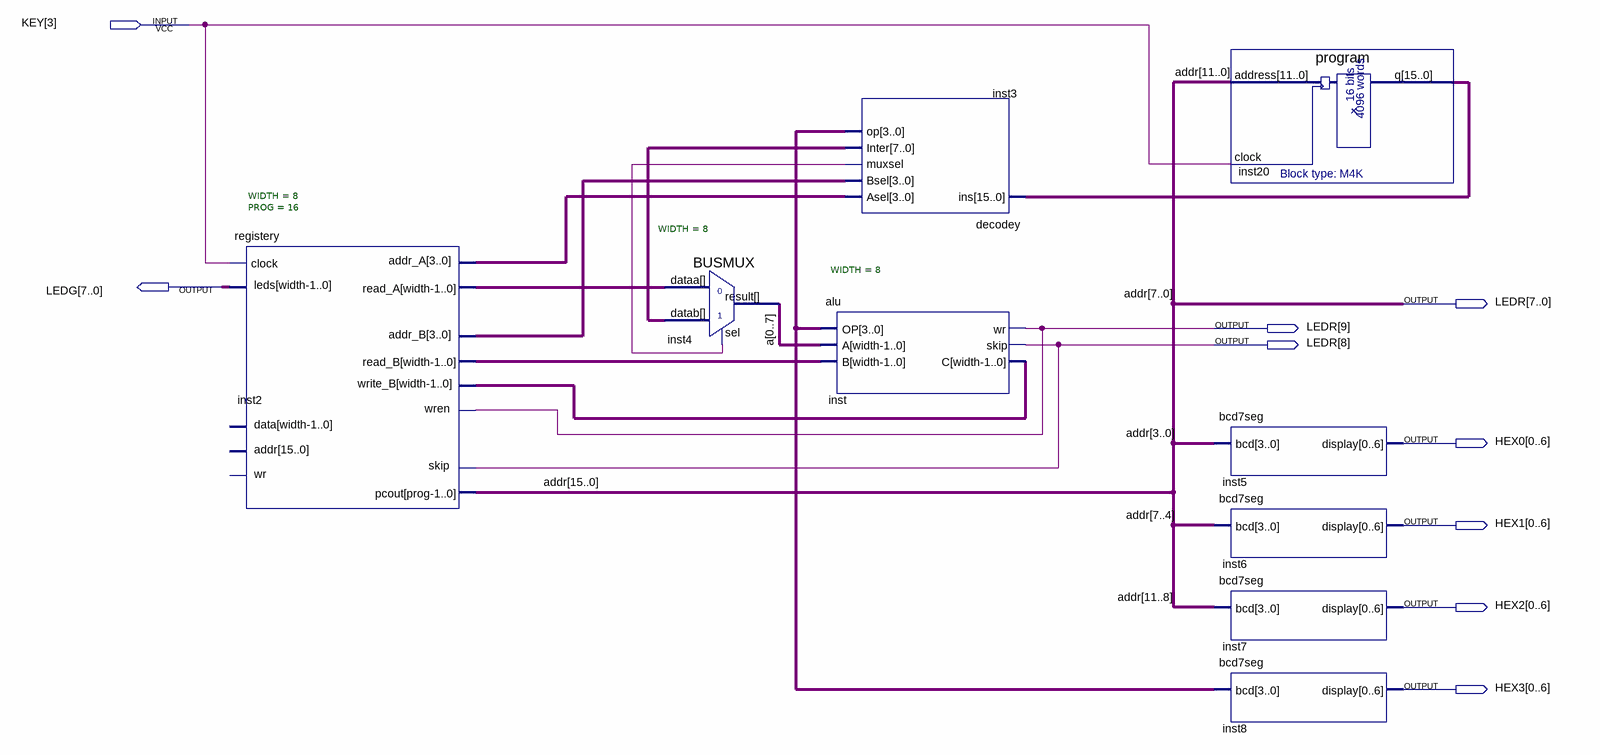
[diagram p0: schematic sheet]
// Quartus schematic SXT8C204.bdf as structural Verilog: 9 symbols, 9 pins
module SXT8C204 (
  input  [3:3] KEY,
  output [7:0] LEDG,
  output [9:0] LEDR,
  output [0:6] HEX0,
  output [0:6] HEX1,
  output [0:6] HEX2,
  output [0:6] HEX3
);

  wire inst3_muxsel;
  wire [3:0] inst3_asel, inst3_bsel, inst3_op;
  wire [7:0] a, inst2_read_a, inst2_read_b, inst3_inter, inst_c;
  wire [15:0] inst20_q;
  wire [15:8] addr;

  registery #(.WIDTH(8), .PROG(16)) inst2 (
    .clock(KEY[3]), .wren(LEDR[9]), .addr_A(inst3_asel), .addr_B(inst3_bsel), .write_B(inst_c),
    .skip(LEDR[8]), .read_A(inst2_read_a), .read_B(inst2_read_b), .leds(LEDG), .pcout({addr, LEDR[7:0]}));  // open: wr, data, addr
  BUSMUX #(.WIDTH(8)) inst4 (
    .datab(inst3_inter), .sel(inst3_muxsel), .dataa(inst2_read_a),
    .result({a[0], a[1], a[2], a[3], a[4], a[5], a[6], a[7]}));
  alu #(.WIDTH(8)) inst (
    .OP(inst3_op), .A({a[0], a[1], a[2], a[3], a[4], a[5], a[6], a[7]}), .B(inst2_read_b), .wr(LEDR[9]),
    .skip(LEDR[8]), .C(inst_c));
  decodey inst3 (
    .ins(inst20_q), .Asel(inst3_asel), .Bsel(inst3_bsel), .muxsel(inst3_muxsel), .Inter(inst3_inter),
    .op(inst3_op));
  \program  inst20 (.address({addr[11:8], LEDR[7:0]}), .clock(KEY[3]), .q(inst20_q));
  bcd7seg inst5 (.bcd(LEDR[3:0]), .display(HEX0));
  bcd7seg inst6 (.bcd(LEDR[7:4]), .display(HEX1));
  bcd7seg inst7 (.bcd(addr[11:8]), .display(HEX2));
  bcd7seg inst8 (.bcd(inst3_op), .display(HEX3));

  // Other names for the same wires on the sheet: addr[7:0] = LEDR[7:0]
endmodule
